# Altium project LIA.PrjPcb
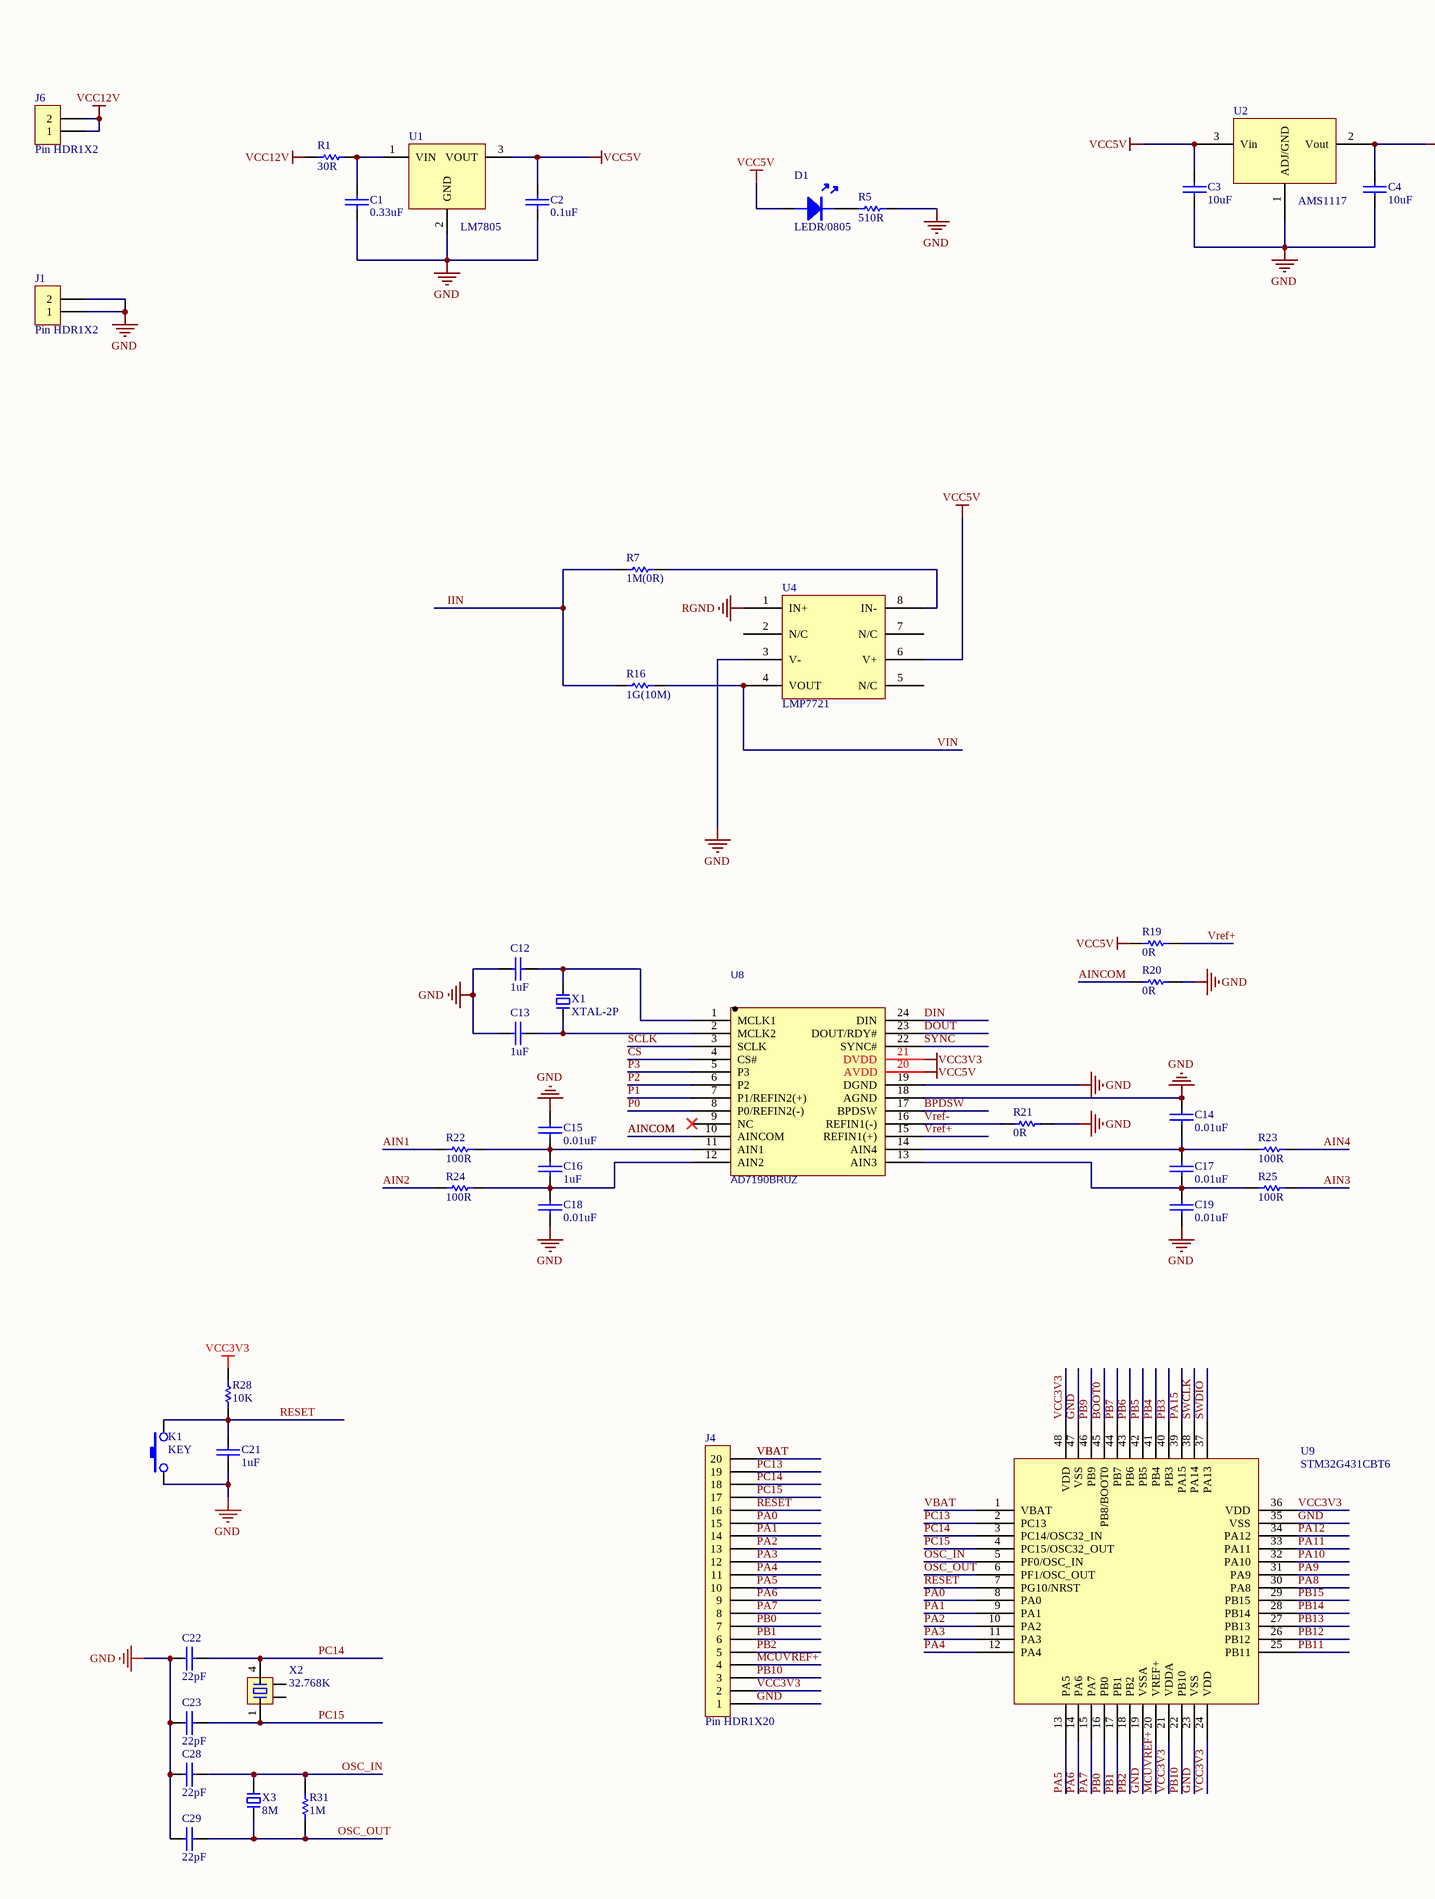
[diagram p0: LIA.SchDoc, left]
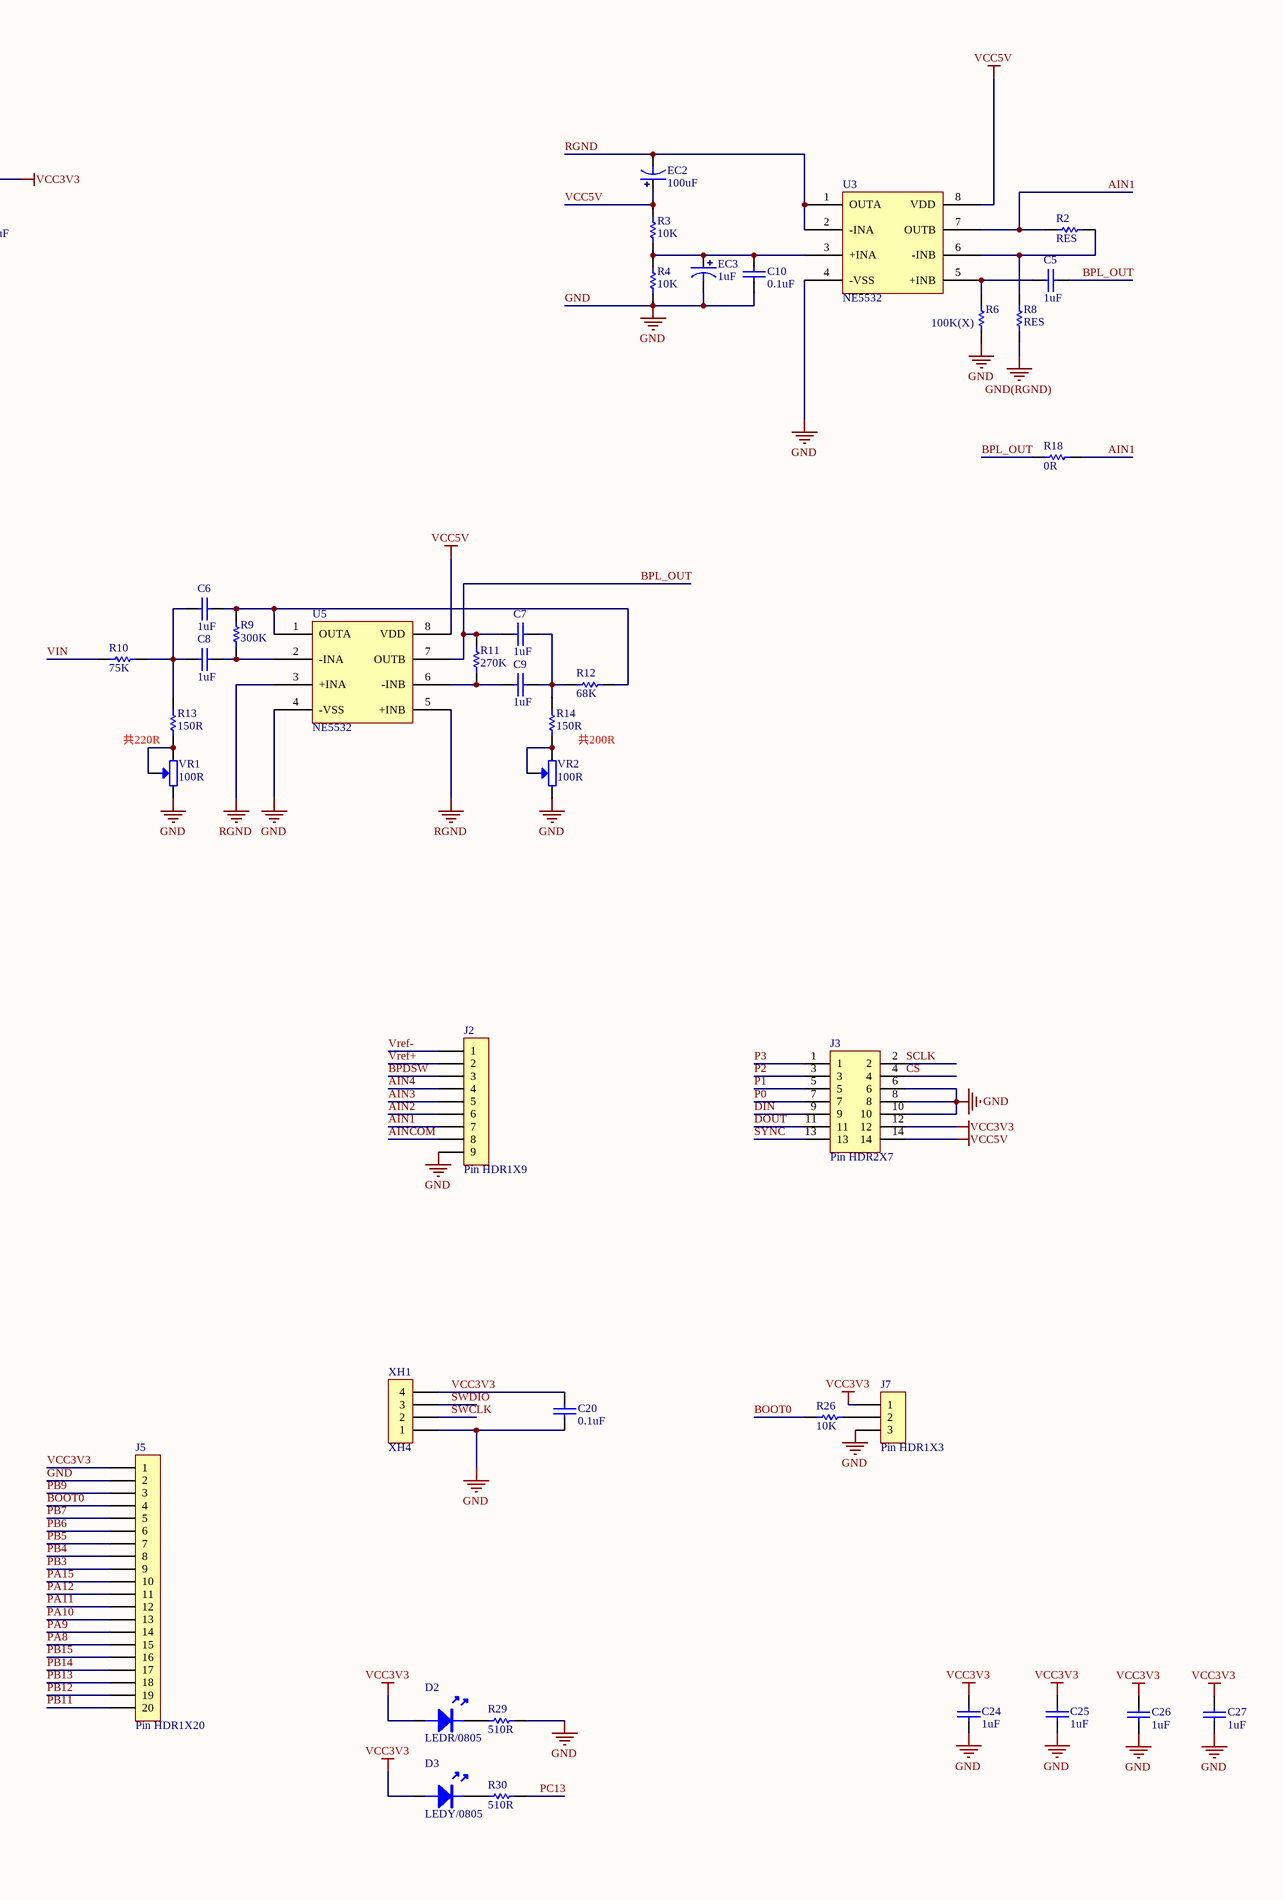
[diagram p1: LIA.SchDoc, right]
1 sheet, 82 parts. Net scope: global (net labels, ports and power ports of the same name join across sheets).
Board file: LIA.PcbDoc

## Sheet LIA.SchDoc
size A2

### Parts
C1  0.33uF  [0603C]
C2  0.1uF  [0603C]
C3  10uF  [0603C]
C4  10uF  [0603C]
C5  1uF  [0603C]
C6  1uF  [DIP-7]
C7  1uF  [DIP-7]
C8  1uF  [DIP-7]
C9  1uF  [DIP-7]
C10  0.1uF  [0603C]
C12  1uF  [0603C]
C13  1uF  [0603C]
C14  0.01uF  [0603C]
C15  0.01uF  [0603C]
C16  1uF  [0603C]
C17  0.01uF  [0603C]
C18  0.01uF  [0603C]
C19  0.01uF  [0603C]
C20  0.1uF  [0603C]
C21  1uF  [0603C]
C22  22pF  [0603C]
C23  22pF  [0603C]
C24  1uF  [0603C]
C25  1uF  [0603C]
C26  1uF  [0603C]
C27  1uF  [0603C]
C28  22pF  [0603C]
C29  22pF  [0603C]
D1  LEDR/0805  [LED-0805R]
D2  LEDR/0805  [LED-0805R]
D3  LEDY/0805  [LED-0805Y]
EC2  100uF  [SMD-EC6.3X6.3X10]
EC3  1uF  [SMD-EC4.0X4.3X5.4]
J1  Pin HDR1X2  [Pin HDR1X2/2.54mm-S]
J2  Pin HDR1X9  [Pin HDR1X9/2.54mm-S]
J3  Pin HDR2X7  [Pin HDR2X7/2.54mm-S]
J4  Pin HDR1X20  [Pin HDR1X20/2.54mm-S]
J5  Pin HDR1X20  [Pin HDR1X20/2.54mm-S]
J6  Pin HDR1X2  [Pin HDR1X2/2.54mm-S]
J7  Pin HDR1X3  [Pin HDR1X3/2.54mm-S]
K1  KEY  [SMD-3X6X2.5]
R1  30R  [0603R]
R2  RES  [0603R]
R3  10K  [0603R]
R4  10K  [0603R]
R5  510R  [0603R]
R6  100K(X)  [0603R]
R7  1M(0R)  [0603R]
R8  RES  [0603R]
R9  300K  [0603R]
R10  75K  [0603R]
R11  270K  [0603R]
R12  68K  [0603R]
R13  150R  [0603R]
R14  150R  [0603R]
R16  1G(10M)  [LONG]
R18  0R  [0603R]
R19  0R  [0603R]
R20  0R  [0603R]
R21  0R  [0603R]
R22  100R  [0603R]
R23  100R  [0603R]
R24  100R  [0603R]
R25  100R  [0603R]
R26  10K  [0603R]
R28  10K  [0603R]
R29  510R  [0603R]
R30  510R  [0603R]
R31  1M  [0603R]
U1  LM7805  [TO252]
U2  AMS1117  [SOT223]
U3  NE5532  [SOP8]
U4  LMP7721  [SOIC-8]
U5  NE5532  [SOP8]
U8  AD7190BRUZ  [TSSOP24]
U9  STM32G431CBT6  [LQFP48 7X7]
VR1  100R  [3296W]
VR2  100R  [3296W]
X1  XTAL-2P  [OSC HC-49S]
X2  32.768K  [OSC MC-306]
X3  8M  [OSC HC-49S]
XH1  XH4  [XH4/2.54mm/180]

### Nets
GND: C1.1 C2.1 C3.1 C4.1 C10.1 C12.2 C13.2 C14.2 C15.2 C18.1 C19.1 C20.1 C21.1 C22.2 C23.2 C24.1 C25.1 C26.1 C27.1 C28.2 C29.2 EC3.2 J1.1 J1.2 J2.9 J3.6 J3.8 J3.10 J4.1 J5.2 J7.3 K1.1 R4.2 R5.2 R6.1 R20.2 R21.2 R29.2 U1.2(GND) U2.1(ADJ/GND) U3.4(-VSS) U4.3(V-) U5.4(-VSS) U8.18(AGND) U8.19(DGND) U9.19(VSSA) U9.23(VSS) U9.35(VSS) U9.47(VSS) VR1.1 VR2.1 XH1.1
GND(RGND): R8.2
RGND: EC2.2 U3.1(OUTA) U3.2(-INA) U4.1(IN+) U5.3(+INA) U5.5(+INB)
VCC3V3: C4.2 C20.2 C24.2 C25.2 C26.2 C27.2 D2.A D3.A J3.12 J4.2 J5.1 J7.1 R28.1 U2.2(Vout) U8.21(DVDD) U9.21(VDDA) U9.24(VDD) U9.36(VDD) U9.48(VDD) XH1.4
VCC5V: C2.2 C3.2 D1.A EC2.1 J3.14 R3.1 R19.1 U1.3(VOUT) U2.3(Vin) U3.8(VDD) U4.6(V+) U5.8(VDD) U8.20(AVDD)
VCC12V: J6.1 J6.2 R1.1
AIN1: J2.7 R2.1 R18.2 R22.1 U3.7(OUTB)
AIN2: J2.6 R24.1
AIN3: J2.5 R25.2
AIN4: J2.4 R23.2
AINCOM: J2.8 R20.1 U8.10(AINCOM)
BOOT0: J5.4 R26.1 U9.45(PB8/BOOT0)
BPDSW: J2.3 U8.17(BPDSW)
BPL_OUT: C5.2 C7.2 R11.2 R18.1 U5.7(OUTB)
CS: J3.4 U8.4(CS#)
DIN: J3.9 U8.24(DIN)
DOUT: J3.11 U8.23(DOUT/RDY#)
IIN: R7.2 R16.1
MCUVREF+: J4.4 U9.20(VREF+)
OSC_IN: C28.1 R31.2 U9.5(PF0/OSC_IN) X3.2
OSC_OUT: C29.1 R31.1 U9.6(PF1/OSC_OUT) X3.1
P0: J3.7 U8.8(P0/REFIN2(-))
P1: J3.5 U8.7(P1/REFIN2(+))
P2: J3.3 U8.6(P2)
P3: J3.1 U8.5(P3)
PA0: J4.15 U9.8(PA0)
PA1: J4.14 U9.9(PA1)
PA2: J4.13 U9.10(PA2)
PA3: J4.12 U9.11(PA3)
PA4: J4.11 U9.12(PA4)
PA5: J4.10 U9.13(PA5)
PA6: J4.9 U9.14(PA6)
PA7: J4.8 U9.15(PA7)
PA8: J5.15 U9.30(PA8)
PA9: J5.14 U9.31(PA9)
PA10: J5.13 U9.32(PA10)
PA11: J5.12 U9.33(PA11)
PA12: J5.11 U9.34(PA12)
PA15: J5.10 U9.39(PA15)
PB0: J4.7 U9.16(PB0)
PB1: J4.6 U9.17(PB1)
PB2: J4.5 U9.18(PB2)
PB3: J5.9 U9.40(PB3)
PB4: J5.8 U9.41(PB4)
PB5: J5.7 U9.42(PB5)
PB6: J5.6 U9.43(PB6)
PB7: J5.5 U9.44(PB7)
PB9: J5.3 U9.46(PB9)
PB10: J4.3 U9.22(PB10)
PB11: J5.20 U9.25(PB11)
PB12: J5.19 U9.26(PB12)
PB13: J5.18 U9.27(PB13)
PB14: J5.17 U9.28(PB14)
PB15: J5.16 U9.29(PB15)
PC13: J4.19 R30.2 U9.2(PC13)
PC14: C22.1 J4.18 U9.3(PC14/OSC32_IN) X2.4
PC15: C23.1 J4.17 U9.4(PC15/OSC32_OUT) X2.1
RESET: C21.2 J4.16 K1.3 R28.2 U9.7(PG10/NRST)
SCLK: J3.2 U8.3(SCLK)
SWCLK: U9.38(PA14) XH1.2
SWDIO: U9.37(PA13) XH1.3
SYNC: J3.13 U8.22(SYNC#)
VBAT: J4.20 U9.1(VBAT)
VIN: R10.2 R16.2 U4.4(VOUT)
Vref+: J2.2 R19.2 U8.15(REFIN1(+))
Vref-: J2.1 R21.1 U8.16(REFIN1(-))
NetC1_2: C1.2 R1.2 U1.1(VIN)
NetC5_1: C5.1 R6.2 U3.5(+INB)
NetC6_1: C6.1 R9.2 R12.1 U5.1(OUTA)
NetC6_2: C6.2 C8.1 R10.1 R13.1
NetC7_1: C7.1 C9.2 R12.2 R14.1
NetC8_2: C8.2 R9.1 U5.2(-INA)
NetC9_1: C9.1 R11.1 U5.6(-INB)
NetC10_2: C10.2 EC3.1 R3.2 R4.1 U3.3(+INA)
NetC12_1: C12.1 U8.1(MCLK1) X1.2
NetC13_1: C13.1 U8.2(MCLK2) X1.1
NetC14_1: C14.1 C17.2 R23.1 U8.14(AIN4)
NetC15_1: C15.1 C16.2 R22.2 U8.11(AIN1)
NetC16_1: C16.1 C18.2 R24.2 U8.12(AIN2)
NetC17_1: C17.1 C19.2 R25.1 U8.13(AIN3)
NetD1_K: D1.K R5.1
NetD2_K: D2.K R29.1
NetD3_K: D3.K R30.1
NetJ7_2: J7.2 R26.2
NetR2_2: R2.2 R8.1 U3.6(-INB)
NetR7_1: R7.1 U4.8(IN-)
NetR13_2: R13.2 VR1.2
NetR14_2: R14.2 VR2.2

Not connected (* = marked no-connect by the designer): U4 2(N/C) 5(N/C) 7(N/C); U8 9(NC)*; X2 2 3

### Notes on the sheet
- 共220R
- 共200R
- (in symbol AD7190BRUZ) .

### Library data of the parts
C1-C10 C12-C29 = CAP: 无极性电容
D1-D3 = LED
EC2 EC3 = SMD_ECAP: 贴片电解电容
R1 R3-R7 R9-R14 R16 R18-R26 R28-R31 = RES
U2 = AMS1117: 三端稳压芯片
U8 = AD7190BRUZ: BOM_Manufacturer: Analog Devices; Contributor: LCSC; BOM_Supplier: LCSC; BOM_Supplier Part: C578396; BOM_Manufacturer Part: AD7190BRUZ; BOM_JLCPCB Part Class: Extended Part; spicePre: U; spiceSymbolName: AD7190BRUZ
VR1 VR2 = RESVR
X1 X3 = XTAL-2P: 2脚无源脚晶振
X2 = XTAL-MC-4P: MC系列4脚晶振